# Altium schematic sheet driver_bridge.SchDoc
size 420 x 297 mm; Address1: Address1; Address2: Address2; Address3: Address3; Address4: Address4; DocumentNumber: АБВГ.123456.001 Э3; SheetNumber: 7; SheetTotal: 7; Scale: 1:1; DocumentType: Схема электрическая принципиальная; FirstReferrence: АБВГ.123456.001
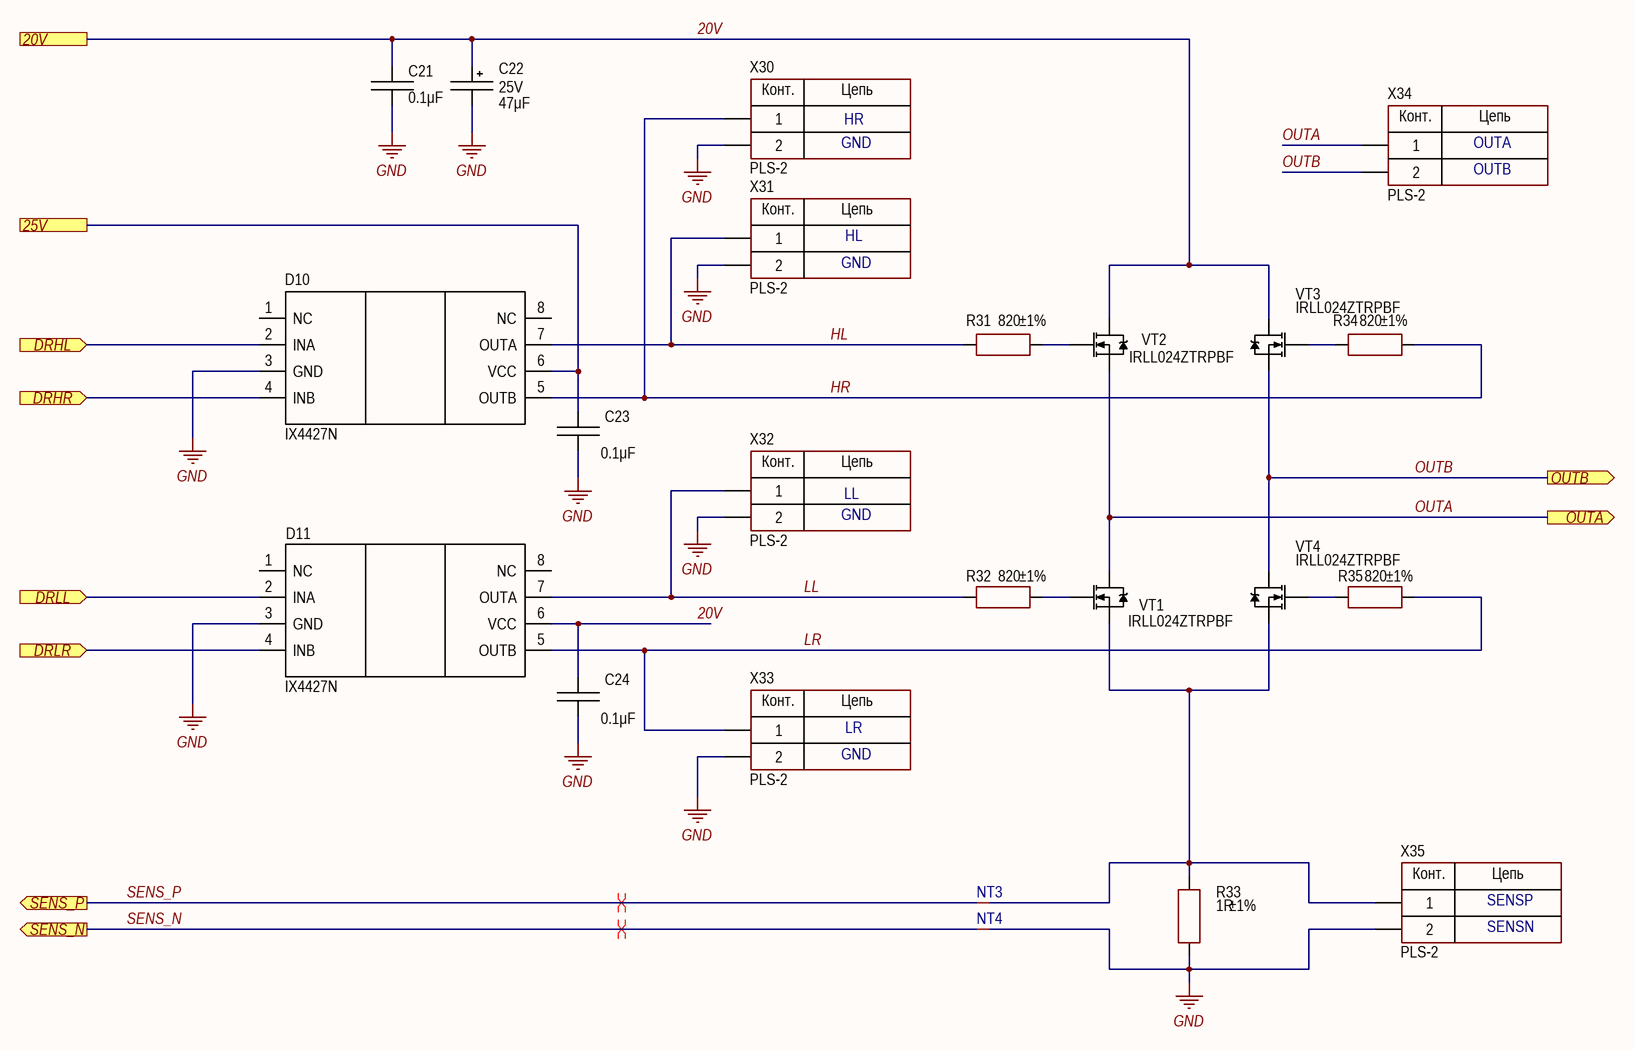
[diagram p0: driver_bridge.SchDoc]

## Parts
C21  value 0.1μF  [CAP: 1206]
C22  value 47μF  Voltage: 25V  [CAP: D6.3C2.5H11]
C23  value 0.1μF  [CAP: 1206]
C24  value 0.1μF  [CAP: 1206]
D10  Ixys Corporation  [8-SOIC]  (value not drawn)
D11  Ixys Corporation  [8-SOIC]  (value not drawn)
NT3  Net_Tie  [NET TIE 0.5_1.5]  (value not drawn)
NT4  Net_Tie  [NET TIE 0.5_1.5]  (value not drawn)
R31  value 820  Tolerance: ±1%  [RES: 1206]
R32  value 820  Tolerance: ±1%  [RES: 1206]
R33  value 1R  Tolerance: ±1%  [RES: 2512]
R34  value 820  Tolerance: ±1%  [RES: 1206]
R35  value 820  Tolerance: ±1%  [RES: 1206]
VT1  PartNumber: IRLL024ZTRPBF  [SOT223]
VT2  PartNumber: IRLL024ZTRPBF  [SOT223]
VT3  PartNumber: IRLL024ZTRPBF  [SOT223]
VT4  PartNumber: IRLL024ZTRPBF  [SOT223]
X30  (no value)  [CON: PLS-2]
X31  (no value)  [CON: PLS-2]
X32  (no value)  [CON: PLS-2]
X33  (no value)  [CON: PLS-2]
X34  (no value)  [CON: PLS-2]
X35  (no value)  [CON: PLS-2]

## Ports
20V, 25V, DRHL (in), DRHR (in), DRLL (in), DRLR (in), OUTA (out), OUTB (out), SENS_N (out), SENS_P (out)

## Nets
GND: C21.1 C22.2 C23.1 C24.1 D10.3(GND) D11.3(GND) NT4.2 R33.1 X30.2 X31.2 X32.2 X33.2 X35.2
20V: C21.2 C22.1 C24.2 D11.6(VCC) VT2.2(D) VT3.2(D) ; port 20V
25V: C23.2 D10.6(VCC) ; port 25V
DRHL: D10.2(INA) ; port DRHL
DRHR: D10.4(INB) ; port DRHR
DRLL: D11.2(INA) ; port DRLL
DRLR: D11.4(INB) ; port DRLR
HL: D10.7(OUTA) R31.1 X31.1
HR: D10.5(OUTB) R34.2 X30.1
LL: D11.7(OUTA) R32.1 X32.1
LR: D11.5(OUTB) R35.2 X33.1
OUTA: VT1.2(D) VT2.3(S) X34.1 ; port OUTA
OUTB: VT3.3(S) VT4.2(D) X34.2 ; port OUTB
SENS_N: NT4.1 ; port SENS_N
SENS_P: NT3.1 ; port SENS_P
NetNT3_2: NT3.2 R33.2 VT1.3(S) VT4.3(S) X35.1
NetR31_2: R31.2 VT2.1(G)
NetR32_2: R32.2 VT1.1(G)
NetR34_1: R34.1 VT3.1(G)
NetR35_1: R35.1 VT4.1(G)

Not connected (* = marked no-connect by the designer): D10 1(NC) 8(NC); D11 1(NC) 8(NC)

## Layout directives
differential pair: SENS_N, SENS_P

## Notes on the sheet
- HR
- GND
- OUTB
- OUTA
- HL
- LL
- LR
- SENSN
- SENSP
- Подп. и дата
- Инв. № дубл.
- Взам. инв. №
- Инв. № подл.
- Изм.
- Лист
- № докум.
- Подп.
- Дата
- 2.106-A3
- Копировал
- Формат А3
- (in symbol PLS-2) Конт.; Цепь

## Library data of the parts
C21 C23 C24 = Ceramic_1206: Manufacturer: Murata Electronics; PartNumber: GRM319R71H104K; ValueManufacturerPartNumber: Ceramic capacitor, 0.1μF, X7R, ±10%, 50V, 1206, -55...+125°C; TypeCapacitor: Ceramic capacitor; Tolerance: ±10%; TypeDielectric: X7R; Voltage: 50V; Package: 1206; HelpURL: https://www.chipdip.ru/product/grm319r71h104k; Temperature: -55...+125°C
C22 = Aluminium: Manufacturer: Wurth; PartNumber: 860080475013; ValueManufacturerPartNumber: Aluminium capacitor, 47μF, 25V, ±20%, 54mOhm, 14x10x5 mm, -55...+105°C; TypeCapacitor: Aluminium capacitor; Tolerance: ±20%; Impedance: 54mOhm; Package: 14x10x5 mm; HelpURL: https://www.digikey.com/product-detail/en/wurth-electronics-inc/860080475013/732-9029-1-ND/5728972; Temperature: -55...+105°C
D10 D11 = IX4427N: Gate driver; Manufacturer: Ixys Corporation; HelpURL: https://www.chipdip.ru/product/ix4427n; Package: SOIC-8; ComponentType: Gate driver; PartNumber: IX4427N
R31 R32 R34 R35 = Resistor_1206: Manufacturer: Yageo; PartNumber: RC1206JR-07100RL; ValueManufacturerPartNumber: Resistor film, 820, ±1%, 1206, 0.25W, -55...+125°C; TypeResistor: Resistor film; Power: 0.25W; Package: 1206; HelpURL: https://www.digikey.com/product-detail/en/yageo/RC1206JR-07100RL/311-100ERCT-ND/732153; Temperature: -55...+125°C
R33 = Resistor_2512: Manufacturer: Yageo; PartNumber: RC2512JK-07100RL; ValueManufacturerPartNumber: Resistor film, 1R, ±1%, 2512, 1W, -55...+125°C; TypeResistor: Resistor film; Power: 1W; Package: 2512; HelpURL: https://www.digikey.com/product-detail/en/yageo/RC2512JK-07100RL/YAG3393CT-ND/5962215; Temperature: -55...+125°C
VT1 = MOSFET_N_123: Manufacturer: Infineon Technologies; TypeTransistor: MOSFET N-channel transistor; VoltageDS: 55V; CurrentD: 4A; RDS: 60mOhm; GateCharge: 7nC ( Typ.); InputCapacitance: 380pF; MaxPower: 1W; Package: SOT-223; HelpURL: https://www.chipdip.ru/product/irll024ztrpbf-infineon; ValueManufacturerPartNumber: =TypeTransistor+', '+VoltageDS+', '+CurrentDS+', '+GateCharge+', '+MaxPower+', '+RDS+', '+InputCapacitor+', '+Package+', '+Temperature; Temperature: -55...+150°C
VT2-VT4 = MOSFET_N_123: Manufacturer: Infineon Technologies; TypeTransistor: MOSFET N-channel transistor; VoltageDS: 55V; CurrentD: 4A; RDS: 60mOhm; GateCharge: 7nC ( Typ.); InputCapacitance: 380pF; MaxPower: 1W; Gate Threshold Voltage: 3V; VGS Max.: ±16V; Package: SOT-223; HelpURL: https://www.chipdip.ru/product/irll024ztrpbf-infineon; ValueManufacturerPartNumber: =TypeTransistor+', '+VoltageDS+', '+CurrentDS+', '+GateCharge+', '+MaxPower+', '+RDS+', '+InputCapacitor+', '+Package+', '+Temperature; Temperature: -55...+150°C
X30-X35 = PLS-2: Manufacturer: Connfly; ValueManufacturerPartNumber: Connector, 2pin, 2.54mm, 500VAC, 3A; TypeConnector: Connector; VoltageMax: 500VAC; Pitch: 2.54mm; CurrentMax: 3A; Multichannel: 2pin; CommentText: "Разъем"; HelpURL: https://www.chipdip.ru/product/pls-2; PartNumber: PLS-2